# EAGLE design Link232-wifi (EAGLE 9.6.2)
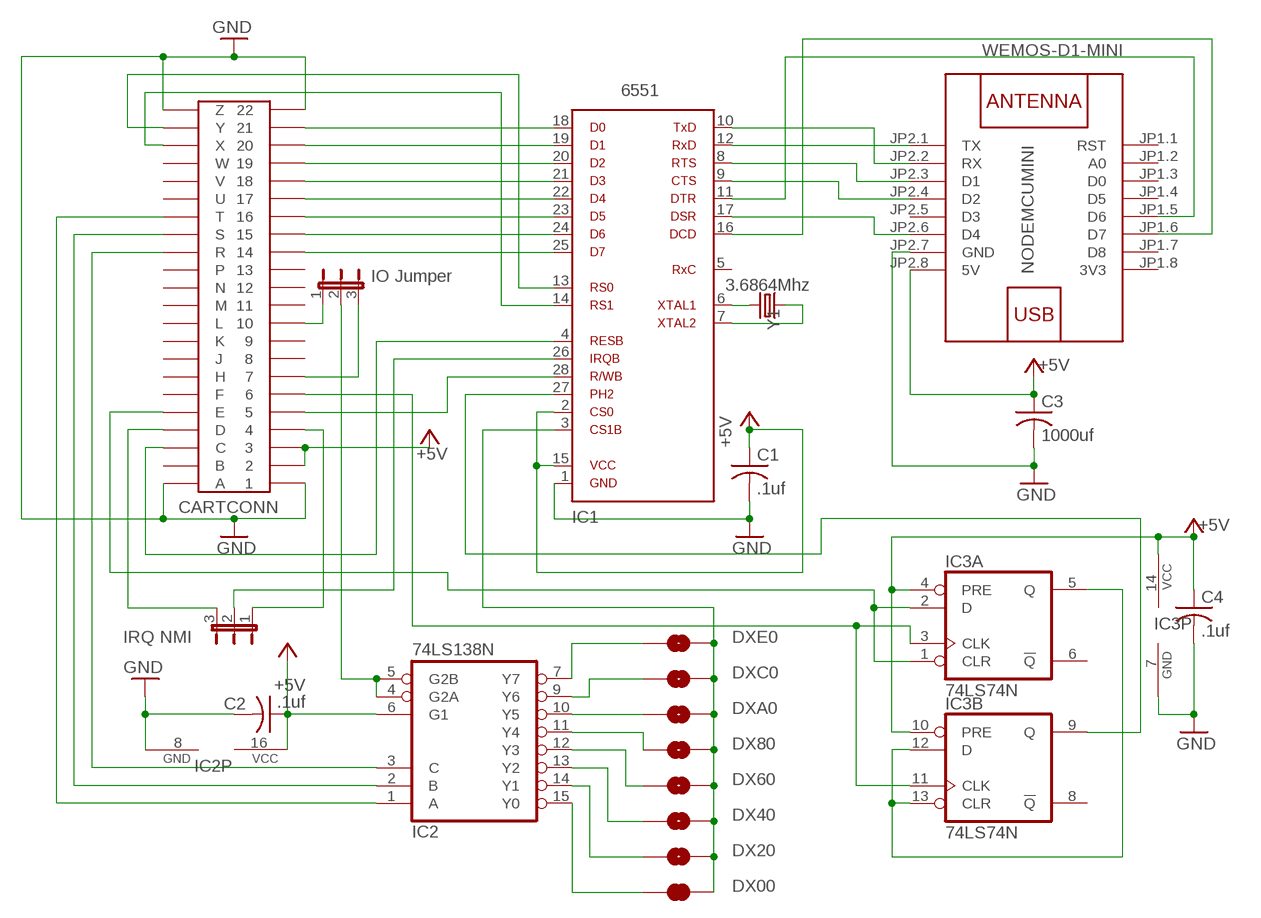
[diagram p0: schematic, sheet 1]

## Parts
C1  .1uf  C-US050-024X044  [C050-024X044]
C2  .1uf  C-US050-024X044  [C050-024X044]
C3  1000uf  C-US050-024X044  [C050-024X044]
C4  .1uf  C-US050-024X044  [C050-024X044]
CARTCONN  44PINEDGE  [44PINEDGE]
DF/DE  IO Jumper  JP2E  [JP2]
DX00  JUMPER-SMT_2_NC_TRACE_SILK  [SMT-JUMPER_2_NC_TRACE_SILK]
DX20  JUMPER-SMT_2_NO_SILK  [SMT-JUMPER_2_NO_SILK]
DX40  JUMPER-SMT_2_NO_SILK  [SMT-JUMPER_2_NO_SILK]
DX60  JUMPER-SMT_2_NO_SILK  [SMT-JUMPER_2_NO_SILK]
DX80  JUMPER-SMT_2_NO_SILK  [SMT-JUMPER_2_NO_SILK]
DXA0  JUMPER-SMT_2_NO_SILK  [SMT-JUMPER_2_NO_SILK]
DXC0  JUMPER-SMT_2_NO_SILK  [SMT-JUMPER_2_NO_SILK]
DXE0  JUMPER-SMT_2_NO_SILK  [SMT-JUMPER_2_NO_SILK]
IC1  6551A  6551  [6551]
IC2  74LS138N  [DIL16]
IC3  74LS74N  [DIL14]
IRQ/NMI  IRQ NMI  JP2E  [JP2]
NODEMCUMINI  WEMOS-D1-MINI  [WEMOS-D1-MINI]
Y1  3.6864Mhz  CRYSTALPTH-HC49US  [HC49US]

## Nets
+5V: C1.1 C2.1 C3.1 C4.1 CARTCONN.2 CARTCONN.3 IC1.2 IC1.15 IC2.6(G1) IC2.16(VCC) IC3.4(A:PRE) IC3.10(B:PRE) IC3.14(P:VCC) NODEMCUMINI.JP2.8(5V)
GND: C1.2 C2.2 C3.2 C4.2 CARTCONN.1 CARTCONN.22 CARTCONN.A CARTCONN.Z IC1.1 IC2.8(GND) IC3.7(P:GND) NODEMCUMINI.JP2.7(GND)
N$1: CARTCONN.6 IC3.3(A:CLK) IC3.11(B:CLK)
N$2: IC3.5(A:Q) IC3.12(B:D) IC3.13(B:CLR)
N$3: IC1.27 IC3.9(B:Q)
N$4: CARTCONN.21 IC1.18
N$5: CARTCONN.20 IC1.19
N$6: CARTCONN.19 IC1.20
N$7: CARTCONN.18 IC1.21
N$8: CARTCONN.17 IC1.22
N$9: IC1.6 Y1.2
N$10: IC1.7 Y1.1
N$11: IC1.12 NODEMCUMINI.JP2.1(TX)
N$12: IC1.10 NODEMCUMINI.JP2.2(RX)
N$13: IC1.8 NODEMCUMINI.JP2.3(D1)
N$14: IC1.9 NODEMCUMINI.JP2.4(D2)
N$15: IC1.17 NODEMCUMINI.JP2.6(D4)
N$16: IC1.11 NODEMCUMINI.JP1.5(D6)
N$17: IC1.16 NODEMCUMINI.JP1.6(D7)
N$18: CARTCONN.5 IC1.28
N$19: CARTCONN.C IC1.4
N$20: CARTCONN.D IRQ/NMI.3
N$21: CARTCONN.E IC3.1(A:CLR) IC3.2(A:D)
N$22: CARTCONN.10 DF/DE.1
N$23: CARTCONN.7 DF/DE.3
N$24: DF/DE.2 IC2.4(G2A) IC2.5(G2B)
N$25: CARTCONN.T IC2.1(A)
N$26: CARTCONN.S IC2.2(B)
N$27: CARTCONN.R IC2.3(C)
N$28: CARTCONN.X IC1.14
N$29: CARTCONN.Y IC1.13
N$30: DXE0.1 IC2.7(Y7)
N$31: CARTCONN.4 IRQ/NMI.1
N$32: DXC0.1 IC2.9(Y6)
N$33: DXA0.1 IC2.10(Y5)
N$34: DX80.1 IC2.11(Y4)
N$35: DX60.1 IC2.12(Y3)
N$36: DX40.1 IC2.13(Y2)
N$37: DX20.1 IC2.14(Y1)
N$38: DX00.1 IC2.15(Y0)
N$39: DX00.2 DX20.2 DX40.2 DX60.2 DX80.2 DXA0.2 DXC0.2 DXE0.2 IC1.3
N$40: CARTCONN.16 IC1.23
N$41: IC1.26 IRQ/NMI.2
N$42: CARTCONN.15 IC1.24
N$43: CARTCONN.14 IC1.25
Unconnected: CARTCONN.8 CARTCONN.9 CARTCONN.11 CARTCONN.12 CARTCONN.13 CARTCONN.B CARTCONN.F CARTCONN.H CARTCONN.J CARTCONN.K CARTCONN.L CARTCONN.M CARTCONN.N CARTCONN.P CARTCONN.U CARTCONN.V CARTCONN.W IC1.5 IC3.6(A:!Q) IC3.8(B:!Q) NODEMCUMINI.JP1.1(RST) NODEMCUMINI.JP1.2(A0) NODEMCUMINI.JP1.3(D0) NODEMCUMINI.JP1.4(D5) NODEMCUMINI.JP1.7(D8) NODEMCUMINI.JP2.5(D3)

## Power pins joined to a net without a drawn wire
3V3: NODEMCUMINI.JP1.8(3V3)

## Library data of the parts
C1-C4 = rcl:C-US: CAPACITOR, American symbol; SPICEPREFIX: C
CARTCONN = edge-100:44PINEDGE: 44 PIN EDGE CONNECTOR FOR PCB
DF/DE IRQ/NMI = jumper:JP2E: JUMPER
DX00 = SparkFun-Jumpers:JUMPER-SMT_2_NC_TRACE: Normally closed trace jumper This jumper has a trace between two pads so it's normally closed (NC). Use a razor knife to open the connection. For best results follow the IPC guidelines for cutting traces: Cutout at least 0.063 mm (0.005 in). Remove all loose material to clean up the cut area. Seal the cut with an approved epoxy. Reapply solder to reclose the connection.
DX20 DX40 DX60 DX80 DXA0 DXC0 DXE0 = SparkFun-Jumpers:JUMPER-SMT_2_NO: Normally open jumper This jumper has two pads in close proximity to each other. Apply solder to close the connection. Round pads are easier to solder for beginners, but are a lot larger. SparkFun Product that uses the round pads: SparkFun EL Sequencer <https://www.sparkfun.com/products/12781>
IC1 = 65xx:6551: Dual In Line
IC2 = 74xx-us:74*138: 3-line to 8-line DECODER/DEMULTIPLEXER
IC3 = 74xx-us:74*74: Dual D type positive edge triggered FLIP FLOP, preset and clear
NODEMCUMINI = diy-modules:WEMOS-D1-MINI: WEMOS D1 mini: Mini Wi-Fi Board based on ESP-8266 device More details can be found here: https://www.wemos.cc/product/d1-mini.html Click here to find device on ebay.com <http://www.ebay.com/sch/wemos+d1+mini+nodemcu>
Y1 = SparkFun-Clocks:CRYSTAL: Crystals (Generic) These are passive quartz crystals, which can be used as a clock source for a microcontroller. Crystal's are two-terminal devices. They require external "load" capacitors to generate an oscillating signal.

## Board
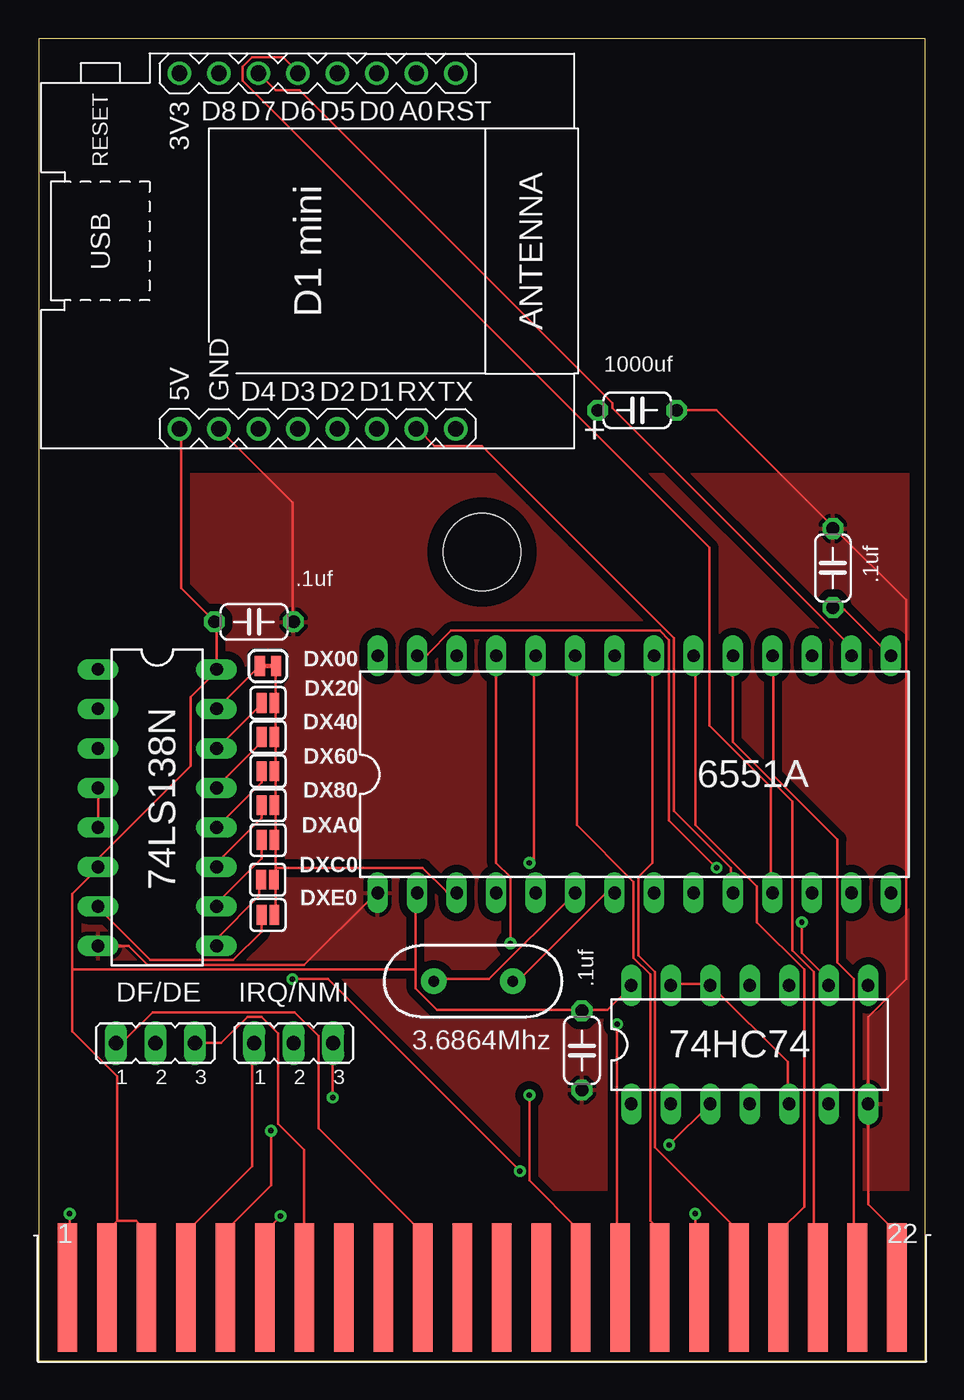
[diagram p1: board, top side]
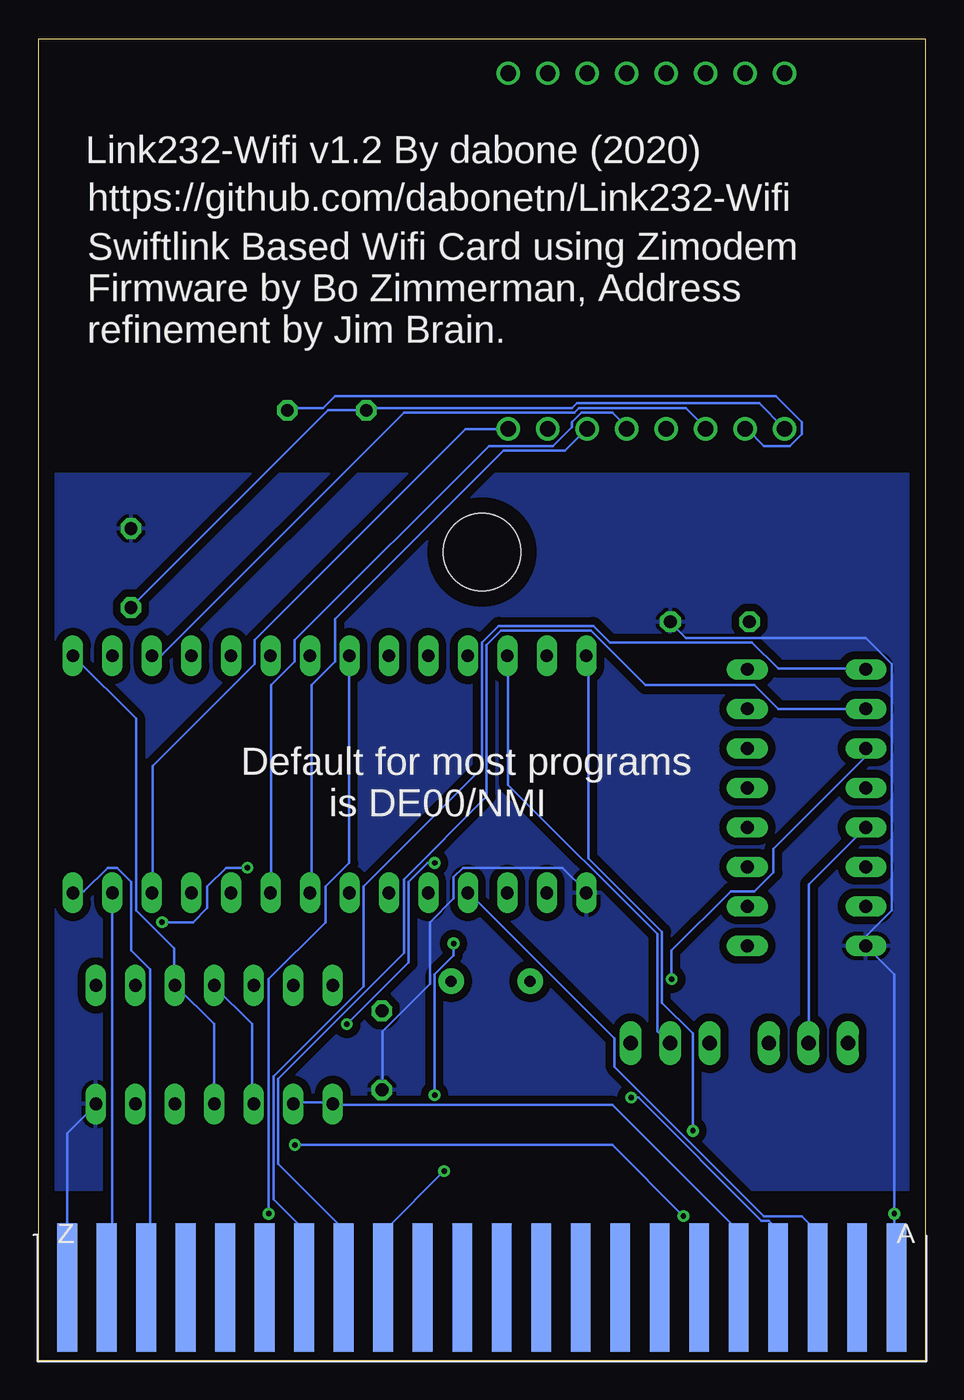
[diagram p2: board, bottom side, seen from below]

Size 57 x 85 mm. Coordinates in mm from the lower left corner, seen from the top.
Outline: 0,0 57,0 57,85 0,85 0,0
Copper layers (1*16): Top 0.035mm / dielectric 1.5mm / Bottom 0.035mm
Design rules "default": minimum track width 6mil, minimum drill 0.35mm, track to track 6mil, track to pad 6mil, pad to pad 6mil, via to via 6mil, smd to smd 6mil, copper to edge 40mil, drill to drill 6mil, minimum pad ring 10mil, minimum via ring 8mil, stop-mask expansion 4mil, vias tented up to drill 0mil, thermal gap 10mil
Holes 5 mm at 28.5,52
tRestrict: area 2.6,0.6 to 3.6,8.8; area 5.2,0.6 to 6.2,8.8; area 7.7,0.6 to 8.7,8.8; area 10.2,0.6 to 11.2,8.8; area 12.8,0.6 to 13.8,8.8; area 15.3,0.6 to 16.3,8.8; area 17.9,0.6 to 18.9,8.8; area 20.4,0.6 to 21.4,8.8; area 22.9,0.6 to 23.9,8.8; area 25.4,0.6 to 26.4,8.8; area 28,0.6 to 29,8.8; area 30.6,0.6 to 31.6,8.8; 11 more areas
bRestrict: area 2.6,0.6 to 3.6,8.8; area 0.1,0.6 to 1.1,8.8; area 5.1,0.6 to 6.1,8.8; area 7.7,0.6 to 8.7,8.8; area 10.2,0.6 to 11.2,8.8; area 12.8,0.6 to 13.7,8.8; area 15.3,0.6 to 16.3,8.8; area 17.8,0.6 to 18.8,8.8; area 20.4,0.6 to 21.4,8.8; area 22.9,0.6 to 23.9,8.8; area 25.5,0.6 to 26.5,8.8; area 28,0.6 to 29,8.8; 11 more areas

### Footprints (pad centres in the part's own frame; a part is rotated, then mirrored left to right if it is on the bottom)
C050-024X044 = drill 0.813 octagon: 1 -2.54,0; 2 2.54,0
44PINEDGE = smd 1.27 x 8.255: 1 -24.765,-0.305; 2 -22.225,-0.305; 3 -19.685,-0.305; 4 -17.145,-0.305; 5 -14.605,-0.305; 6 -12.065,-0.305; 7 -9.525,-0.305; 8 -6.985,-0.305; 9 -4.445,-0.305; 10 -1.905,-0.305; 11 0.635,-0.305; 12 3.175,-0.305; 13 5.715,-0.305; 14 8.255,-0.305; 15 10.795,-0.305; 16 13.335,-0.305; 17 15.875,-0.305; 18 18.415,-0.305; 19 20.955,-0.305; 20 23.495,-0.305; 21 26.035,-0.305; 22 28.575,-0.305 | smd 1.27 x 8.255 bottom: A -24.765,-0.305; B -22.225,-0.305; C -19.685,-0.305; D -17.145,-0.305; E -14.605,-0.305; F -12.065,-0.305; H -9.525,-0.305; J -6.985,-0.305; K -4.445,-0.305; L -1.905,-0.305; M 0.635,-0.305; N 3.175,-0.305; P 5.715,-0.305; R 8.255,-0.305; S 10.795,-0.305; T 13.335,-0.305; U 15.875,-0.305; V 18.415,-0.305; W 20.955,-0.305; X 23.495,-0.305; Y 26.035,-0.305; Z 28.575,-0.305
JP2 = drill 0.914 long: 1 -2.54,0; 2 0,0; 3 2.54,0
SMT-JUMPER_2_NC_TRACE_SILK = smd 0.66 x 1.27: 1 -0.521,0; 2 0.521,0
SMT-JUMPER_2_NO_SILK = smd 0.635 x 1.27: 1 -0.406,0; 2 0.406,0
6551 = drill 0.813 long: 1 -16.51,-7.62; 2 -13.97,-7.62; 3 -11.43,-7.62; 4 -8.89,-7.62; 5 -6.35,-7.62; 6 -3.81,-7.62; 7 -1.27,-7.62; 8 1.27,-7.62; 9 3.81,-7.62; 10 6.35,-7.62; 11 8.89,-7.62; 12 11.43,-7.62; 13 13.97,-7.62; 14 16.51,-7.62; 15 16.51,7.62; 16 13.97,7.62; 17 11.43,7.62; 18 8.89,7.62; 19 6.35,7.62; 20 3.81,7.62; 21 1.27,7.62; 22 -1.27,7.62; 23 -3.81,7.62; 24 -6.35,7.62; 25 -8.89,7.62; 26 -11.43,7.62; 27 -13.97,7.62; 28 -16.51,7.62
DIL16 = drill 0.813 long: 1 -8.89,-3.81; 2 -6.35,-3.81; 3 -3.81,-3.81; 4 -1.27,-3.81; 5 1.27,-3.81; 6 3.81,-3.81; 7 6.35,-3.81; 8 8.89,-3.81; 9 8.89,3.81; 10 6.35,3.81; 11 3.81,3.81; 12 1.27,3.81; 13 -1.27,3.81; 14 -3.81,3.81; 15 -6.35,3.81; 16 -8.89,3.81
DIL14 = drill 0.813 long: 1 -7.62,-3.81; 2 -5.08,-3.81; 3 -2.54,-3.81; 4 0,-3.81; 5 2.54,-3.81; 6 5.08,-3.81; 7 7.62,-3.81; 8 7.62,3.81; 9 5.08,3.81; 10 2.54,3.81; 11 0,3.81; 12 -2.54,3.81; 13 -5.08,3.81; 14 -7.62,3.81
WEMOS-D1-MINI = drill 1: JP1.1 -11.43,9.525; JP1.2 -11.43,6.985; JP1.3 -11.43,4.445; JP1.4 -11.43,1.905; JP1.5 -11.43,-0.635; JP1.6 -11.43,-3.175; JP1.7 -11.43,-5.715; JP1.8 -11.43,-8.255; JP2.1 11.43,9.525; JP2.2 11.43,6.985; JP2.3 11.43,4.445; JP2.4 11.43,1.905; JP2.5 11.43,-0.635; JP2.6 11.43,-3.175; JP2.7 11.43,-5.715; JP2.8 11.43,-8.255
HC49US = drill 0.7 pad 1.651: 1 -2.54,0; 2 2.54,0

### Placement (x,y rotation side)
C1  51.07,50.97 90 top
C2  13.84,47.51 0 top
C3  38.48,61.12 0 top
C4  34.93,19.95 270 top
CARTCONN  26.6,5.01 0 top
DF/DE  7.5,20.42 0 top
DX00  14.74,44.67 0 top
DX20  14.74,42.29 0 top
DX40  14.74,40.1 0 top
DX60  14.74,37.91 0 top
DX80  14.74,35.72 0 top
DXA0  14.74,33.48 0 top
DXC0  14.71,30.93 0 top
DXE0  14.74,28.66 0 top
IC1  38.3,37.7 0 top
IC2  7.62,35.56 270 top
IC3  45.72,20.32 0 top
IRQ/NMI  16.39,20.42 0 top
NODEMCUMINI  17.28,71.36 270 top
Y1  27.94,24.4 180 top

### Tracks (layer width: path | path; a pad name or v marks a point on that pad's centre or on a via)
+5V
  Top 0.152: C1.1 51.21,48.31 51.82,48.31 54.71,45.41 IC1.15 | IC3.14 38.1,24.08 36.58,22.55 35.05,22.55 C4.1 34.9,22.55 25.6,22.55 24.23,23.93 24.23,25.15 | 24.23,25.15 24.23,30.02 IC1.2 | 5.03,8.99 4.42,8.38 4.42,4.72 CARTCONN.2 | 5.03,8.99 6.25,8.99 6.86,8.38 6.86,4.72 CARTCONN.3 | NODEMCUMINI.JP2.8 9.14,59.89 9.14,49.68 11.28,47.55 C2.1 11.43,47.4 IC2.16 11.43,44.35 9.75,42.67 9.75,38.25 3.81,32.31 IC2.6 3.81,31.7 2.13,30.02 2.13,25.15 | 5.03,8.99 5.03,18.29 2.13,21.18 2.13,25.15 | 2.13,25.15 24.23,25.15
  Bottom 0.152: IC3.4 45.72,21.64 48.16,24.08 IC3.10 48.31,24.23 48.31,26.52 50.75,28.96 50.75,41.3 54.71,45.26 IC1.15 | C1.1 51.05,48.46 38.41,61.11 35.97,61.11 C3.1 35.81,61.27 22.71,61.27 22.4,61.57 10.67,61.57 9.14,60.05 NODEMCUMINI.JP2.8
GND  (via drill 0.35)
  Top 0.152: v1.98,9.45 1.98,4.72 CARTCONN.A | IC2.8 5.79,26.67 7.01,25.45 17.07,25.45 21.64,30.02 IC1.1 | CARTCONN.22 55.17,4.72 55.17,8.23 53.34,10.06 IC3.7 53.34,22.1 55.78,24.54 55.78,48.92 51.21,53.49 C1.2 51.05,53.65 43.59,61.11 41.15,61.11 C3.2 | C2.2 16.31,47.55 16.31,55.17 11.58,59.89 NODEMCUMINI.JP2.7
  Bottom 0.152: CARTCONN.A 1.98,4.72 v1.98,9.45 1.98,24.84 IC2.8 3.81,27.28 2.13,28.96 2.13,44.81 3.81,46.48 15.39,46.48 16.31,47.4 C2.2 | C4.2 34.9,17.53 34.9,21.18 31.85,24.23 31.85,28.19 30.33,29.72 30.33,31.09 29.72,31.7 23.32,31.7 21.79,30.18 IC1.1 | CARTCONN.22 55.17,4.72 55.17,14.63 53.34,16.46 IC3.7 | C3.2 41,61.27 38.71,61.27 37.95,62.03 9.6,62.03 7.92,60.35 7.92,59.59 8.69,58.83 10.36,58.83 11.43,59.89 NODEMCUMINI.JP2.7
  pour Top (isolate 0.5): 0,11 57,11 57,57 0,57
  pour Bottom (isolate 0.5): 57,11 0,11 0,57 57,57
N$1  (via drill 0.35)
  Top 0.152: v40.54,13.87 IC3.3 | v15.54,9.3 14.63,8.38 14.63,4.72 CARTCONN.6
  Bottom 0.152: IC3.3 43.28,16.61 43.28,21.64 45.72,24.08 IC3.11 | v40.54,13.87 20.12,13.87 v15.54,9.3
N$2
  Top 0.152: IC3.5 48.16,16.61 48.16,19.2 43.28,24.08 IC3.12 43.13,24.23 40.69,24.23 IC3.13
N$3  (via drill 0.35)
  Top 0.152: v43.59,31.7 40.54,34.75 40.54,46.33 39.93,46.94 26.52,46.94 24.99,45.41 24.38,45.41 IC1.27 | v49.07,28.19 49.07,26.21 50.75,24.54 50.75,24.23 IC3.9
  Bottom 0.152: v43.59,31.7 44.96,31.7 46.18,30.48 46.18,29.11 47.09,28.19 v49.07,28.19
N$4
  Top 0.152: IC1.18 47.24,45.26 47.24,37.64 51.36,33.53 51.36,25.6 52.43,24.54 52.43,4.88 52.58,4.72 CARTCONN.21
N$5
  Top 0.152: IC1.19 44.65,45.26 44.65,39.78 48.46,35.97 48.46,26.36 49.84,24.99 49.84,4.88 49.99,4.72 CARTCONN.20
N$6
  Top 0.152: IC1.20 42.22,45.26 42.22,34.44 46.18,30.48 46.18,28.19 49.23,25.15 49.23,9.91 47.7,8.38 47.7,4.72 CARTCONN.19
N$7
  Top 0.152: IC1.21 39.47,45.26 39.47,32 38.56,31.09 38.56,26.06 39.62,24.99 39.62,13.72 44.96,8.38 44.96,4.72 CARTCONN.18
N$8  (via drill 0.35)
  Top 0.152: v42.22,9.45 42.22,4.88 42.37,4.72 CARTCONN.17
  Bottom 0.152: v42.22,9.45 42.22,24.54 38.56,28.19 38.56,30.48 37.03,32 37.03,45.26 IC1.22
N$9
  Top 0.152: IC1.6 34.44,30.02 28.96,24.54 25.45,24.54 Y1.2
N$10
  Top 0.152: IC1.7 36.88,30.02 36.42,30.02 30.94,24.54 30.48,24.54 Y1.1
N$11
  Bottom 0.152: IC1.12 49.68,30.18 49.68,38.25 43.13,44.81 43.13,46.33 29.57,59.89 26.82,59.89 NODEMCUMINI.JP2.1
N$12
  Top 0.152: IC1.10 44.5,30.18 44.5,31.7 40.84,35.36 40.84,46.48 28.5,58.83 25.45,58.83 24.38,59.89 NODEMCUMINI.JP2.2
N$13
  Bottom 0.152: IC1.8 39.47,30.18 39.47,43.43 37.95,44.96 37.95,47.7 27.13,58.52 23.16,58.52 21.79,59.89 NODEMCUMINI.JP2.3
N$14
  Bottom 0.152: IC1.9 42.06,30.18 42.06,43.43 40.54,44.96 40.54,46.33 28.04,58.83 23.93,58.83 22.71,60.05 22.71,60.35 22.1,60.96 20.12,60.96 19.2,60.05 NODEMCUMINI.JP2.4
N$15
  Bottom 0.152: IC1.17 49.68,45.41 49.07,45.41 33.53,60.96 22.55,60.96 22.25,61.27 15.39,61.27 14.17,60.05 NODEMCUMINI.JP2.6
N$16
  Top 0.152: IC1.11 47.09,30.18 47.09,36.88 43.13,40.84 43.13,52.27 13.11,82.3 13.11,83.21 13.72,83.82 15.7,83.82 16.61,82.91 NODEMCUMINI.JP1.5
N$17
  Top 0.152: IC1.16 52.12,45.41 52.12,46.02 36.88,61.27 36.88,61.57 16.76,81.69 15.24,81.69 14.17,82.75 NODEMCUMINI.JP1.6
N$18  (via drill 0.35)
  Top 0.152: v14.94,14.78 14.94,11.28 12.04,8.38 12.04,4.72 CARTCONN.5
  Bottom 0.152: v14.94,14.78 14.94,21.03 16.92,23.01 16.92,27.58 21.64,32.31 21.64,45.26 IC1.28
N$19
  Bottom 0.152: IC1.4 29.26,30.02 19.96,20.73 19.96,18.9 10.36,9.3 7.92,9.3 7.01,8.38 7.01,4.72 CARTCONN.C
N$20  (via drill 0.35)
  Top 0.152: v18.9,16.92 18.9,20.27 IRQ/NMI.3
  Bottom 0.152: v18.9,16.92 18.44,16.92 10.52,8.99 10.06,8.99 9.6,8.53 9.6,4.72 CARTCONN.D
N$21
  Bottom 0.152: IC3.2 40.54,16.61 38.1,16.61 IC3.1 38.1,16.46 20.12,16.46 12.04,8.38 12.04,4.72 CARTCONN.E
N$22
  Top 0.152: DF/DE.1 5.03,20.42 5.33,20.42 7.32,22.4 16.46,22.4 17.98,20.88 17.98,14.94 24.69,8.23 24.69,4.72 CARTCONN.10
N$23
  Top 0.152: DF/DE.3 10.06,20.42 11.73,20.42 13.41,22.1 14.33,22.1 15.39,21.03 15.39,15.24 17.07,13.56 17.07,4.72 CARTCONN.7
N$24
  Top 0.152: IC2.4 IC2.5
  Bottom 0.152: IC2.5 7.47,30.63 7.47,20.42 DF/DE.2
N$25
  Bottom 0.152: IC2.1 3.81,44.5 9.45,44.5 11.12,46.18 20.27,46.18 21.34,47.24 27.43,47.24 28.5,46.18 28.5,38.1 36.12,30.48 36.12,24.08 41.91,18.29 41.91,10.36 40.08,8.53 40.08,4.72 CARTCONN.T
N$26
  Bottom 0.152: IC2.2 9.45,41.91 10.97,43.43 17.98,43.43 21.49,46.94 27.28,46.94 28.19,46.02 28.19,36.27 33.53,30.94 33.53,26.21 41.6,18.14 41.6,12.65 37.49,8.53 37.49,4.72 CARTCONN.S
N$27  (via drill 0.35)
  Top 0.152: v16.31,24.54 18.59,24.54 v30.94,12.19
  Bottom 0.152: IC2.3 3.81,38.86 9.75,32.92 9.75,31.39 10.97,30.18 12.5,30.18 16.31,26.36 v16.31,24.54 | v30.94,12.19 34.75,8.38 34.75,4.72 CARTCONN.R
N$28
  Bottom 0.152: IC1.14 54.71,30.18 54.1,30.18 52.58,31.7 51.97,31.7 51.05,30.79 51.05,26.36 49.84,25.15 49.84,4.88 49.99,4.72 CARTCONN.X
N$29
  Bottom 0.152: IC1.13 52.27,30.02 52.27,5.03 52.58,4.72 CARTCONN.Y
N$30
  Top 0.152: DXE0.1 14.33,27.58 12.5,25.76 7.16,25.76 3.81,29.11 IC2.7
N$31
  Top 0.152: IRQ/NMI.1 13.72,20.27 13.72,12.5 9.6,8.38 9.6,4.72 CARTCONN.4
N$32
  Top 0.152: IC2.9 11.43,27.13 14.17,29.87 14.17,30.79 DXC0.1
N$33
  Top 0.152: IC2.10 11.43,29.41 14.33,32.31 14.33,33.38 DXA0.1
N$34
  Top 0.152: IC2.11 11.43,32 14.33,34.9 14.33,35.66 DX80.1
N$35
  Top 0.152: IC2.12 14.33,37.19 14.33,37.8 DX60.1
N$36
  Top 0.152: DX40.1 14.33,40.08 14.33,39.78 11.43,36.88 IC2.13
N$37
  Top 0.152: DX20.1 14.33,42.22 11.43,39.32 IC2.14
N$38
  Top 0.152: IC2.15 14.17,44.65 DX00.1
N$39
  Top 0.152: DX00.2 15.24,44.65 15.24,42.37 DX20.2 15.24,42.22 15.24,40.23 DX40.2 15.24,40.08 15.24,37.95 DX60.2 15.24,37.8 15.24,35.81 DX80.2 15.24,35.66 15.24,33.53 DXA0.2 15.24,33.38 15.24,31.7 | DXE0.2 15.24,28.8 15.24,30.79 DXC0.2 15.24,30.94 15.24,31.7 | 15.24,31.7 24.69,31.7 26.21,30.18 26.82,30.18 IC1.3
N$40
  Top 0.152: IC1.23 34.59,45.26 34.59,34.44 38.25,30.79 38.25,25.91 39.32,24.84 39.32,8.99 39.93,8.38 39.93,4.72 CARTCONN.16
N$41
  Bottom 0.152: IC1.26 26.82,45.26 26.82,37.03 17.22,27.43 17.22,21.18 16.46,20.42 IRQ/NMI.2
N$42  (via drill 0.35)
  Top 0.152: v31.55,32 31.85,32.31 31.85,45.26 IC1.24 | v37.19,21.64 37.19,4.88 37.34,4.72 CARTCONN.15
  Bottom 0.152: v31.55,32 32,32 33.22,30.79 33.22,25.6 v37.19,21.64
N$43  (via drill 0.35)
  Top 0.152: v30.33,26.82 30.33,31.09 29.41,32 29.41,45.26 IC1.25 | v31.55,17.07 31.55,11.58 34.75,8.38 34.75,4.72 CARTCONN.14
  Bottom 0.152: v30.33,26.82 30.33,26.06 31.55,24.84 v31.55,17.07

### Text on the board
tPlace: 1000uf | + | .1uf | .1uf | 74LS138N | 6551A | .1uf | 3.6864Mhz | 74HC74
bPlace: Link232-Wifi v1.2 By dabone (2020) | https://github.com/dabonetn/Link232-Wifi | Swiftlink Based Wifi Card using Zimodem / Firmware by Bo Zimmerman, Address / refinement by Jim Brain. | Default for most programs / is DE00/NMI